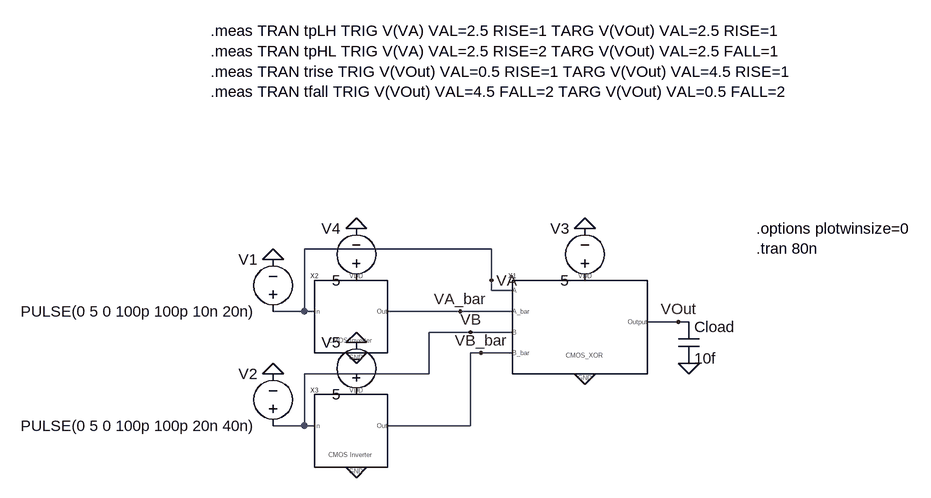
[diagram p0: schematic CMOS_XOR_test.asc]
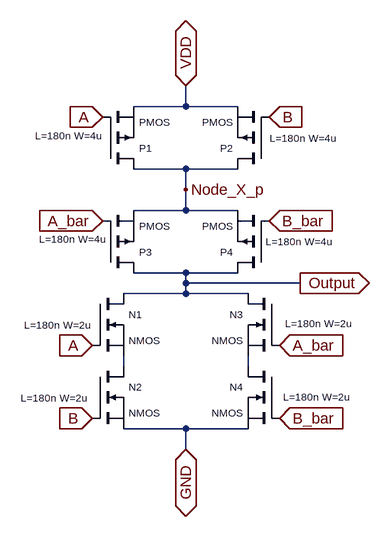
[diagram p1: sub-circuit cmos_xor.asc]
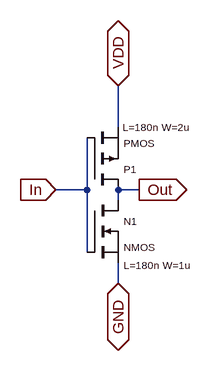
[diagram p2: sub-circuit cmos_inveter.asc]
CMOS_XOR_test.asc, the LTspice schematic file:
Version 4.1
SHEET 1 880 680
WIRE 96 0 -192 0
WIRE 96 48 96 0
WIRE 96 64 96 48
WIRE 128 64 96 64
WIRE -192 96 -192 0
WIRE -192 96 -240 96
WIRE -176 96 -192 96
WIRE 48 96 -64 96
WIRE 128 96 48 96
WIRE 384 112 336 112
WIRE 400 112 384 112
WIRE 64 128 0 128
WIRE 128 128 64 128
WIRE 80 160 64 160
WIRE 128 160 80 160
WIRE 0 192 0 128
WIRE 0 192 -192 192
WIRE -192 272 -192 192
WIRE -192 272 -240 272
WIRE -176 272 -192 272
WIRE 64 272 64 160
WIRE 64 272 -64 272
FLAG -240 16 0
FLAG -240 192 0
FLAG 240 192 0
FLAG 240 -32 0
FLAG 96 48 VA
FLAG 48 96 VA_bar
FLAG 64 128 VB
FLAG 80 160 VB_bar
FLAG 384 112 VOut
FLAG -112 -32 0
FLAG -112 144 0
FLAG -112 336 0
FLAG -112 160 0
FLAG 400 176 0
SYMBOL CMOS_XOR 224 112 R0
SYMATTR InstName X1
SYMBOL CMOS_Inveter -128 96 R0
SYMATTR InstName X2
SYMBOL CMOS_Inveter -128 272 R0
SYMATTR InstName X3
SYMBOL voltage -240 112 R180
WINDOW 0 24 96 Left 2
WINDOW 3 24 16 Left 2
WINDOW 123 0 0 Left 0
WINDOW 39 0 0 Left 0
SYMATTR InstName V1
SYMATTR Value PULSE(0 5 0 100p 100p 10n 20n)
SYMBOL voltage -240 288 R180
WINDOW 0 24 96 Left 2
WINDOW 3 24 16 Left 2
WINDOW 123 0 0 Left 0
WINDOW 39 0 0 Left 0
SYMATTR InstName V2
SYMATTR Value PULSE(0 5 0 100p 100p 20n 40n)
SYMBOL voltage 240 64 R180
WINDOW 0 24 96 Left 2
WINDOW 3 24 16 Left 2
WINDOW 123 0 0 Left 0
WINDOW 39 0 0 Left 0
SYMATTR InstName V3
SYMATTR Value 5
SYMBOL voltage -112 64 R180
WINDOW 0 24 96 Left 2
WINDOW 3 24 16 Left 2
WINDOW 123 0 0 Left 0
WINDOW 39 0 0 Left 0
SYMATTR InstName V4
SYMATTR Value 5
SYMBOL voltage -112 240 R180
WINDOW 0 24 96 Left 2
WINDOW 3 24 16 Left 2
WINDOW 123 0 0 Left 0
WINDOW 39 0 0 Left 0
SYMATTR InstName V5
SYMATTR Value 5
SYMBOL cap 384 112 R0
SYMATTR InstName Cload
SYMATTR Value 10f
TEXT 504 -32 Left 2 !.options plotwinsize=0\n.tran 80n
TEXT -336 -336 Left 2 !.meas TRAN tpLH TRIG V(VA) VAL=2.5 RISE=1 TARG V(VOut) VAL=2.5 RISE=1\n.meas TRAN tpHL TRIG V(VA) VAL=2.5 RISE=2 TARG V(VOut) VAL=2.5 FALL=1\n.meas TRAN trise TRIG V(VOut) VAL=0.5 RISE=1 TARG V(VOut) VAL=4.5 RISE=1\n.meas TRAN tfall TRIG V(VOut) VAL=4.5 FALL=2 TARG V(VOut) VAL=0.5 FALL=2

cmos_xor.asc, the sub-circuit schematic file:
Version 4.1
SHEET 1 880 680
WIRE 208 -192 208 -224
WIRE 208 -192 128 -192
WIRE 288 -192 208 -192
WIRE 208 -96 128 -96
WIRE 288 -96 208 -96
WIRE 208 -64 208 -96
WIRE 208 -32 208 -64
WIRE 208 -32 128 -32
WIRE 288 -32 208 -32
WIRE 208 64 128 64
WIRE 288 64 208 64
WIRE 208 80 208 64
WIRE 384 80 208 80
WIRE 208 96 208 80
WIRE 208 96 112 96
WIRE 304 96 208 96
WIRE 112 208 112 192
WIRE 304 208 304 192
WIRE 208 304 112 304
WIRE 304 304 208 304
WIRE 208 336 208 304
FLAG 64 176 A
IOPIN 64 176 In
FLAG 64 288 B
IOPIN 64 288 In
FLAG 352 176 A_bar
IOPIN 352 176 In
FLAG 352 288 B_bar
IOPIN 352 288 In
FLAG 208 336 GND
IOPIN 208 336 BiDir
FLAG 208 -224 VDD
IOPIN 208 -224 BiDir
FLAG 384 80 Output
IOPIN 384 80 Out
FLAG 80 -176 A
IOPIN 80 -176 In
FLAG 80 -16 A_bar
IOPIN 80 -16 In
FLAG 336 -176 B
IOPIN 336 -176 In
FLAG 336 -16 B_bar
IOPIN 336 -16 In
FLAG 208 -64 Node_X_p
SYMBOL nmos 64 208 R0
WINDOW 0 56 32 Left 1
WINDOW 3 56 72 Left 1
WINDOW 123 -110 49 Left 1
SYMATTR InstName N2
SYMATTR Value2 L=180n W=2u
SYMBOL nmos 64 96 R0
WINDOW 0 56 32 Left 1
WINDOW 3 56 72 Left 1
WINDOW 123 -105 48 Left 1
SYMATTR InstName N1
SYMATTR Value2 L=180n W=2u
SYMBOL nmos 352 96 M0
WINDOW 0 56 32 Left 1
WINDOW 3 56 72 Left 1
WINDOW 123 -110 46 Left 1
SYMATTR InstName N3
SYMATTR Value2 L=180n W=2u
SYMBOL nmos 352 208 M0
WINDOW 0 56 32 Left 1
WINDOW 3 56 72 Left 1
WINDOW 123 -107 47 Left 1
SYMATTR InstName N4
SYMATTR Value2 L=180n W=2u
SYMBOL pmos 80 64 M180
WINDOW 0 56 32 Left 1
WINDOW 3 56 72 Left 1
WINDOW 123 251 48 Left 1
SYMATTR InstName P3
SYMATTR Value2 L=180n W=4u
SYMBOL pmos 336 64 R180
WINDOW 0 56 32 Left 1
WINDOW 3 56 72 Left 1
WINDOW 123 252 52 Left 1
SYMATTR InstName P4
SYMATTR Value2 L=180n W=4u
SYMBOL pmos 336 -96 R180
WINDOW 0 56 32 Left 1
WINDOW 3 56 72 Left 1
WINDOW 123 258 51 Left 1
SYMATTR InstName P2
SYMATTR Value2 L=180n W=4u
SYMBOL pmos 80 -96 M180
WINDOW 0 56 32 Left 1
WINDOW 3 56 72 Left 1
WINDOW 123 257 47 Left 1
SYMATTR InstName P1
SYMATTR Value2 L=180n W=4u

cmos_inveter.asc, the sub-circuit schematic file:
Version 4.1
SHEET 1 880 680
WIRE -112 -32 -112 -96
WIRE -160 64 -160 -16
WIRE -160 64 -208 64
WIRE -80 64 -112 64
WIRE -112 80 -112 64
WIRE -160 160 -160 64
WIRE -112 208 -112 176
FLAG -80 64 Out
IOPIN -80 64 Out
FLAG -208 64 In
IOPIN -208 64 In
FLAG -112 -96 VDD
IOPIN -112 -96 BiDir
FLAG -112 208 GND
IOPIN -112 208 BiDir
SYMBOL nmos -160 80 R0
WINDOW 0 56 32 Left 1
WINDOW 3 56 72 Left 1
WINDOW 123 56 100 Left 1
SYMATTR InstName N1
SYMATTR Value2 L=180n W=1u
SYMBOL pmos -160 64 M180
WINDOW 0 56 32 Left 1
WINDOW 3 56 72 Left 1
WINDOW 123 55 96 Left 1
SYMATTR InstName P1
SYMATTR Value2 L=180n W=2u

The netlist it stands for:
* CMOS_XOR_test.asc
X§X1 VA VA_bar VB VB_bar 0 VOut P001 cmos_xor
X§X2 VA 0 VA_bar P002 cmos_inveter
X§X3 VB 0 VB_bar P003 cmos_inveter
V1 VA 0 PULSE(0 5 0 100p 100p 10n 20n)
V2 VB 0 PULSE(0 5 0 100p 100p 20n 40n)
V3 P001 0 5
V4 P002 0 5
V5 P003 0 5
Cload VOut 0 10f

* block symbol definitions
.subckt cmos_xor A A_bar B B_bar GND Output VDD
M§N2 N001 B GND GND NMOS L=180n W=2u
M§N1 Output A N001 N001 NMOS L=180n W=2u
M§N3 Output A_bar N002 N002 NMOS L=180n W=2u
M§N4 N002 B_bar GND GND NMOS L=180n W=2u
M§P3 Output A_bar Node_X_p Node_X_p PMOS L=180n W=4u
M§P4 Output B_bar Node_X_p Node_X_p PMOS L=180n W=4u
M§P2 Node_X_p B VDD VDD PMOS L=180n W=4u
M§P1 Node_X_p A VDD VDD PMOS L=180n W=4u
.ends cmos_xor

.subckt cmos_inveter In GND Out VDD
M§N1 Out In GND GND NMOS L=180n W=1u
M§P1 Out In VDD VDD PMOS L=180n W=2u
.ends cmos_inveter

.model NMOS NMOS
.model PMOS PMOS
.lib standard.mos
.options plotwinsize=0
.tran 80n
.meas TRAN tpLH TRIG V(VA) VAL=2.5 RISE=1 TARG V(VOut) VAL=2.5 RISE=1
.meas TRAN tpHL TRIG V(VA) VAL=2.5 RISE=2 TARG V(VOut) VAL=2.5 FALL=1
.meas TRAN trise TRIG V(VOut) VAL=0.5 RISE=1 TARG V(VOut) VAL=4.5 RISE=1
.meas TRAN tfall TRIG V(VOut) VAL=4.5 FALL=2 TARG V(VOut) VAL=0.5 FALL=2
.backanno
.end

* Results of the author's LTspice run, read from the files saved beside the schematic
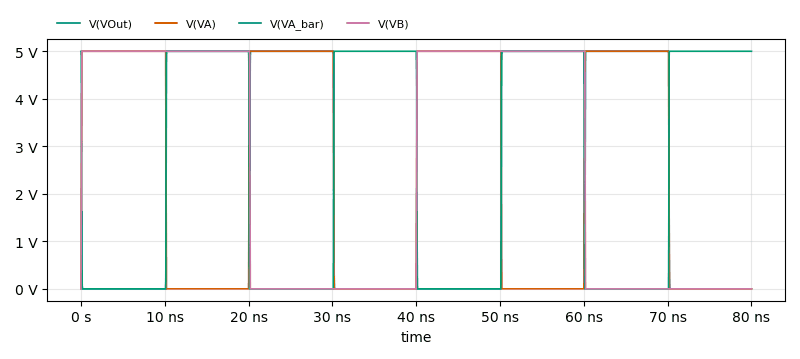
[diagram p3: Transient Analysis of CMOS_XOR_test.asc, plotted from the saved traces]
* Transient Analysis, 1 run:
*   V(VOut): min -3.025 µV, max 5 V, average 2.495 V, rms 3.526 V, last 0 V
*   V(VA): min 0 V, max 5 V, average 2.525 V, rms 3.547 V, last 0 V
*   V(VA_bar): min 0 V, max 5 V, average 2.48 V, rms 3.519 V, last 5 V
*   V(VB): min 0 V, max 5 V, average 2.513 V, rms 3.542 V, last 0 V
* From the log:
*   tplh=1.01087533215e-08 FROM 5.00000003031e-11 TO 1.01587533218e-08
*   tphl=4.18509780357e-11 FROM 2.00499999988e-08 TO 2.00918509768e-08
*   trise=1.01252407128e-08 FROM 5.98840132044e-11 TO 1.0185124726e-08
*   tfall=5.39829056639e-11 FROM 3.01454139595e-08 TO 3.01993968652e-08